# EAGLE design RedBoard (EAGLE 7.7.0)
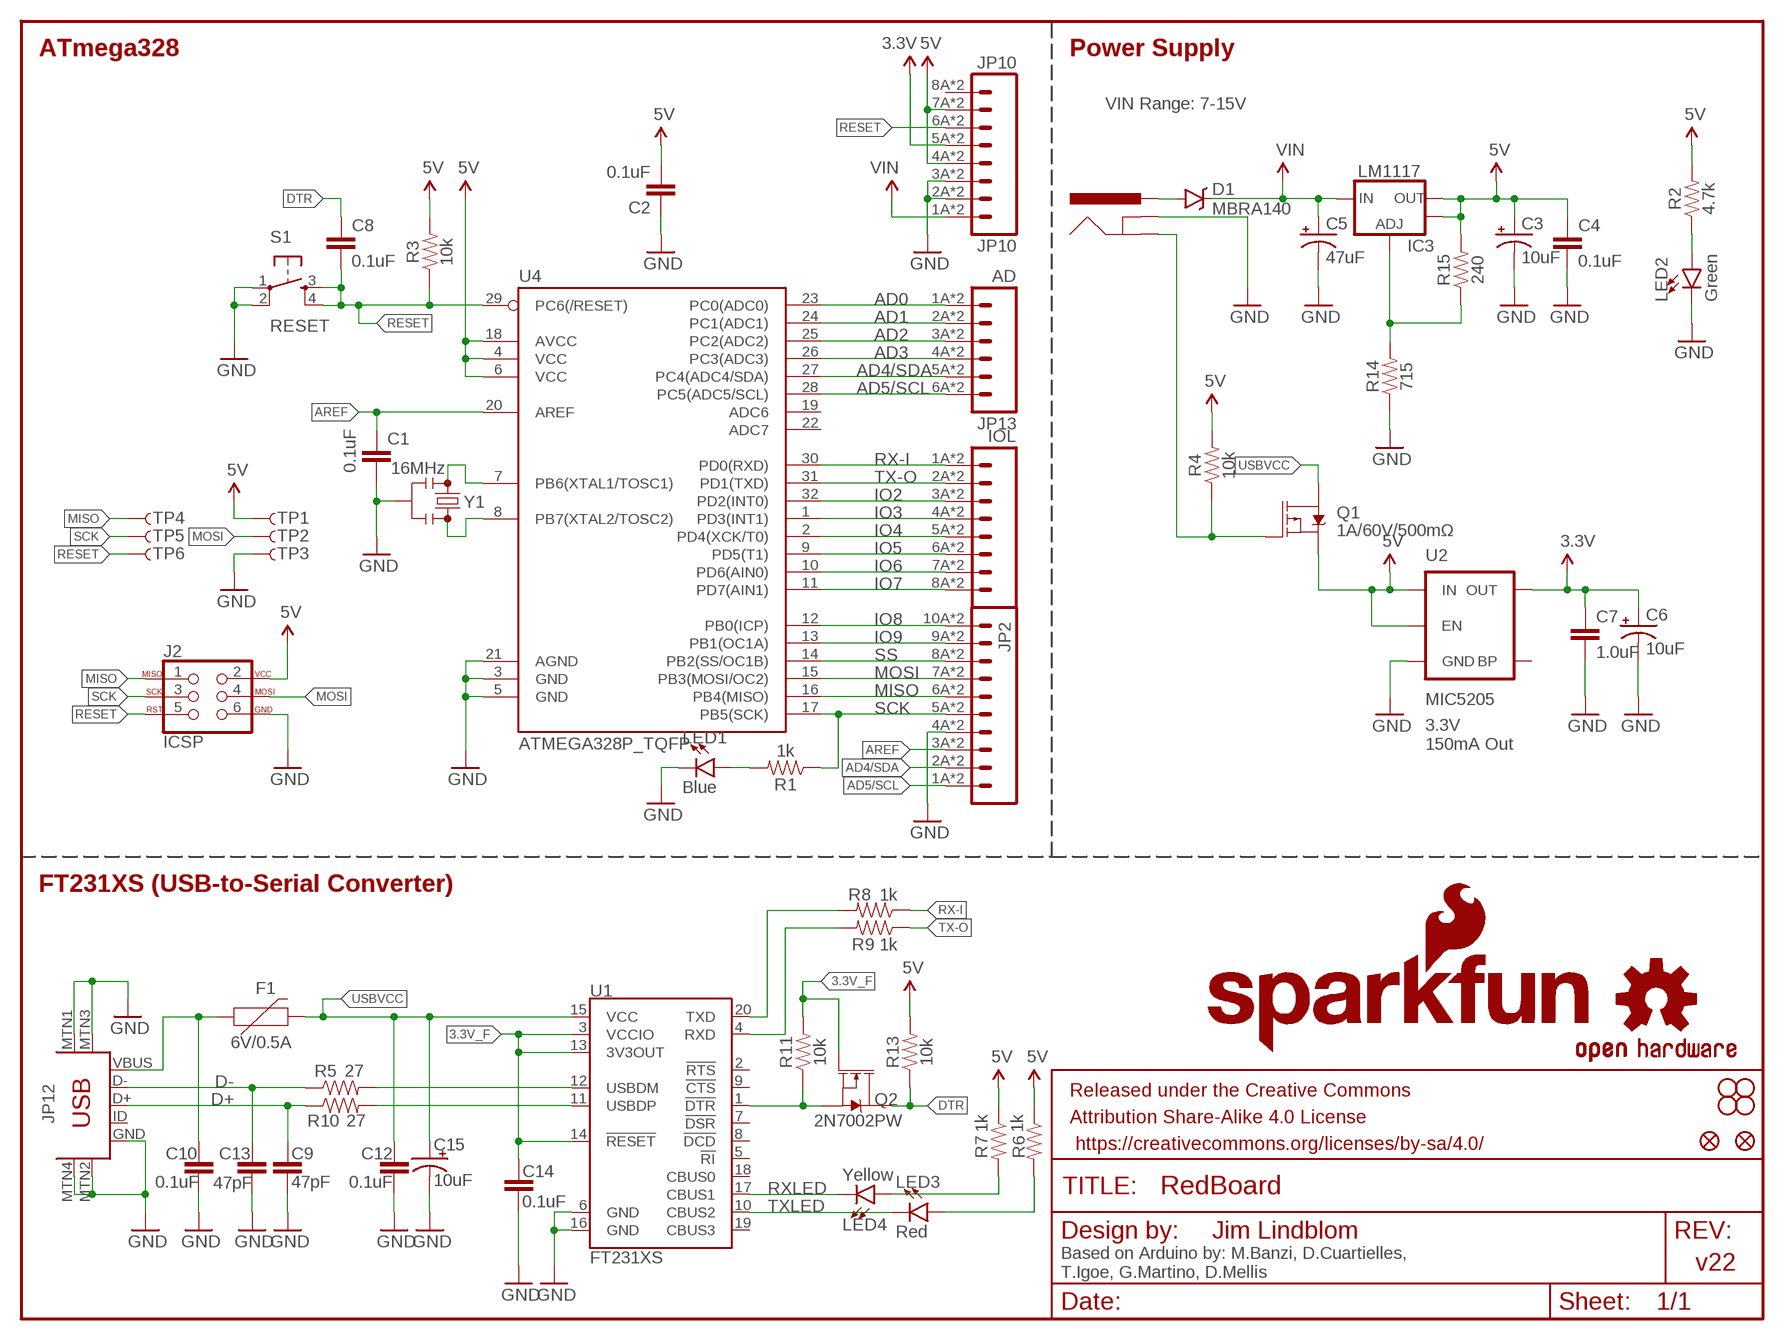
[diagram p0: schematic, sheet 1]

## Parts
C1  0.1uF  0.1UF-0603-25V-(+80/-20%)  [0603]
C2  0.1uF  0.1UF-0603-25V-(+80/-20%)  [0603]
C3  10uF  10UF-POLAR-EIA3216-16V-10%(TANT)  [EIA3216]
C4  0.1uF  0.1UF-0603-25V-(+80/-20%)  [0603]
C5  47uF  47UF-POLAR-PANASONIC_D-35V-20%  [PANASONIC_D]
C6  10uF  10UF-POLAR-EIA3216-16V-10%(TANT)  [EIA3216]
C7  1.0uF  1.0UF-0603-16V-10%  [0603]
C8  0.1uF  0.1UF-0603-25V-(+80/-20%)  [0603]
C9  47pF  47PF-0603-50V-5%  [0603]
C10  0.1uF  0.1UF-0603-25V-(+80/-20%)  [0603]
C12  0.1uF  0.1UF-0603-25V-(+80/-20%)  [0603]
C13  47pF  47PF-0603-50V-5%  [0603]
C14  0.1uF  0.1UF-0603-25V-(+80/-20%)  [0603]
C15  10uF  10UF-POLAR-EIA3216-16V-10%(TANT)  [EIA3216]
D1  MBRA140  [SMA-DIODE]
F1  6V/0.5A  PTC-HALF_AMP  [1206]
FRAME2  FRAME-LETTER  [CREATIVE_COMMONS]
IC3  LM1117  V_REG_LM1117ALT1  [SOT223-ALT1]
J2  ICSP  AVR_SPI_PROG_3X2SMD  [2X3_SMT_POSTS]
J3  POWER_JACKSUPER_BOMB_DIGITY  [POWER_JACK_SMD_OVERPASTE_SUPER_BOMB_DIGITY]
JP1  SFE_LOGO_NAME.1_INCH  [SFE_LOGO_NAME_.1]
JP2  M10SMD_COMBO  [1X10_SMD_COMBINED]
JP3  STAND-OFF  [STAND-OFF]
JP4  STAND-OFF  [STAND-OFF]
JP5  STAND-OFF  [STAND-OFF]
JP6  STAND-OFF  [STAND-OFF]
JP7  SFE_LOGO_FLAME.1_INCH  [SFE_LOGO_FLAME_.1]
JP8  FIDUCIAL1X2  [FIDUCIAL-1X2]
JP9  FIDUCIAL1X2  [FIDUCIAL-1X2]
JP10  JP10  M08SMD-COMBO  [1X08_SMD_COMBINED]
JP11  IOL  M08SMD-COMBO  [1X08_SMD_COMBINED]
JP12  USB-MINIB-5PIN  [USB-MINIB]
JP13  AD  M06SMD-STRAIGHT-COMBO  [1X06_SMD_STRAIGHT_COMBO]
LED1  Blue  LED1206  [LED-1206]
LED2  Green  LED1206  [LED-1206]
LED3  Red  LED1206  [LED-1206]
LED4  Yellow  LED1206  [LED-1206]
Q1  1A/60V/500mΩ  MOSFET-PCH-ZXMP6A13F  [SOT23-3]
Q2  2N7002PW  MOSFET-NCH-2N7002PW  [SOT323]
R1  1k  1KOHM-0603-1/10W-1%  [0603]
R2  4.7k  4.7KOHM-0603-1/10W-1%  [0603]
R3  10k  10KOHM-0603-1/10W-1%  [0603]
R4  10k  10KOHM-0603-1/10W-1%  [0603]
R5  27  27OHM-0603-1/10W-1%  [0603]
R6  1k  1KOHM-0603-1/10W-1%  [0603]
R7  1k  1KOHM-0603-1/10W-1%  [0603]
R8  1k  1KOHM-0603-1/10W-1%  [0603]
R9  1k  1KOHM-0603-1/10W-1%  [0603]
R10  27  27OHM-0603-1/10W-1%  [0603]
R11  10k  10KOHM-0603-1/10W-1%  [0603]
R13  10k  10KOHM-0603-1/10W-1%  [0603]
R14  715  715OHM-0603-1/10W-1%  [0603]
R15  240  240OHM-0603-1/10W-1%  [0603]
S1  RESET  SWITCH_SPST_4_PINSQUARE  [TACTILE-SWITCH-SMD]
TP1  TP-3x5  TEST-POINT3X5  [PAD.03X.05]
TP2  TP-3x5  TEST-POINT3X5  [PAD.03X.05]
TP3  TP-3x5  TEST-POINT3X5  [PAD.03X.05]
TP4  TP-3x5  TEST-POINT3X5  [PAD.03X.05]
TP5  TP-3x5  TEST-POINT3X5  [PAD.03X.05]
TP6  TP-3x5  TEST-POINT3X5  [PAD.03X.05]
U1  FT231XS  [SSOP20_L]
U2  MIC5205  MIC52053.3V  [SOT23-5]
U4  ATMEGA328P_TQFP  [TQFP32-08]
U$16  OSHW-LOGOS  [OSHW-LOGO-S]
Y1  16MHz  RESONATOR-16MHZSMD_3.2X1.3  [RESONATOR-SMD-3.2X1.3]

## Nets
3.3V: C6.+ C7.1 JP10.5A JP10.5B U2.5(OUT)
3.3V_F: C14.1 Q2.1(G) R11.2 U1.3(VCCIO) U1.13(3V3OUT) U1.14(!RESET)
5V: C2.2 C3.+ C4.1 IC3.2(OUT) IC3.4(OUT) J2.2 JP10.4A JP10.4B JP10.7A JP10.7B Q1.2(S) R2.2 R3.2 R4.2 R6.1 R7.1 R13.2 R15.2 TP1.P$1 U2.1(IN) U2.3(EN) U4.4(VCC) U4.6(VCC) U4.18(AVCC)
AD0: JP13.1A JP13.1B U4.23(PC0(ADC0))
AD1: JP13.2A JP13.2B U4.24(PC1(ADC1))
AD2: JP13.3A JP13.3B U4.25(PC2(ADC2))
AD3: JP13.4A JP13.4B U4.26(PC3(ADC3))
AD4/SDA: JP2.2A JP2.2B JP13.5A JP13.5B U4.27(PC4(ADC4/SDA))
AD5/SCL: JP2.1A JP2.1B JP13.6A JP13.6B U4.28(PC5(ADC5/SCL))
AREF: C1.1 JP2.3A JP2.3B U4.20(AREF)
D+: C9.1 JP12.D+ R10.1
D-: C13.1 JP12.D- R5.1
DTR: C8.1 Q2.3(D) R13.1
FTDI_DTR: Q2.2(S) R11.1 U1.1(!DTR)
GND: C1.2 C2.1 C3.- C4.2 C5.- C6.- C7.2 C9.2 C10.2 C12.2 C13.2 C14.2 C15.- J2.6 J3.GND(GNDBREAK) JP2.4A JP2.4B JP10.2A JP10.2B JP10.3A JP10.3B JP12.GND JP12.MTN1(MTN2) JP12.MTN2(MTN3) JP12.MTN3(MTN1) JP12.MTN4 LED1.C LED2.C R14.1 S1.1 S1.2 TP3.P$1 U1.6(GND) U1.16(GND) U2.2(GND) U4.3(GND) U4.5(GND) U4.21(AGND) Y1.2
INSERT: J3.P$4(GND) Q1.1(G) R4.1
IO2: JP11.3A JP11.3B U4.32(PD2(INT0))
IO3: JP11.4A JP11.4B U4.1(PD3(INT1))
IO4: JP11.5A JP11.5B U4.2(PD4(XCK/T0))
IO5: JP11.6A JP11.6B U4.9(PD5(T1))
IO6: JP11.7A JP11.7B U4.10(PD6(AIN0))
IO7: JP11.8A JP11.8B U4.11(PD7(AIN1))
IO8: JP2.10A JP2.10B U4.12(PB0(ICP))
IO9: JP2.9A JP2.9B U4.13(PB1(OC1A))
MISO: J2.1 JP2.6A JP2.6B TP4.P$1 U4.16(PB4(MISO))
MOSI: J2.4 JP2.7A JP2.7B TP2.P$1 U4.15(PB3(MOSI/OC2))
N$1: LED1.A R1.2
N$2: LED2.A R2.1
N$3: U4.7(PB6(XTAL1/TOSC1)) Y1.1
N$4: U4.8(PB7(XTAL2/TOSC2)) Y1.3
N$6: R5.2 U1.12(USBDM)
N$7: R10.2 U1.11(USBDP)
N$8: LED3.A R6.2
N$10: LED4.A R7.2
N$15: IC3.1(ADJ) R14.2 R15.1
PWRIN: D1.A J3.VIN0(PWR)
RESET: C8.2 J2.5 JP10.6A JP10.6B R3.1 S1.3 S1.4 TP6.P$1 U4.29(PC6(/RESET))
RX-I: JP11.1A JP11.1B R8.1 U4.30(PD0(RXD))
RXD: R9.2 U1.4(RXD)
RXLED: LED4.C U1.17(CBUS1)
SCK: J2.3 JP2.5A JP2.5B R1.1 TP5.P$1 U4.17(PB5(SCK))
SS: JP2.8A JP2.8B U4.14(PB2(SS/OC1B))
TX-O: JP11.2A JP11.2B R9.1 U4.31(PD1(TXD))
TXD: R8.2 U1.20(TXD)
TXLED: LED3.C U1.10(CBUS2)
USBVCC: C12.1 C15.+ F1.2 Q1.3(D) U1.15(VCC)
VIN: C5.+ D1.C IC3.3(IN) JP10.1A JP10.1B
VUSB: C10.1 F1.1 JP12.VBUS
Unconnected: JP10.8A JP10.8B JP12.ID U1.2(!RTS) U1.5(!RI) U1.7(!DSR) U1.8(!DCD) U1.9(!CTS) U1.18(CBUS0) U1.19(CBUS3) U2.4(BP) U4.19(ADC6) U4.22(ADC7)

## Notes on the sheet
- ATmega328 | Power Supply
- VIN Range: 7-15V
- 3.3V
  150mA Out
- FT231XS (USB-to-Serial Converter)
- Jim Lindblom
- v22
- Based on Arduino by: M.Banzi, D.Cuartielles, 
  T.Igoe, G.Martino, D.Mellis

## Library data of the parts
C1 C2 C4 C8 C10 C12 C14 = SparkFun-Capacitors:0.1UF: 0.1µF ceramic capacitors A capacitor is a passive two-terminal electrical component used to store electrical energy temporarily in an electric field.; PROD_ID: CAP-00810
C3 C6 C15 = SparkFun-Capacitors:10UF-POLAR: 10.0µF polarized capacitors A capacitor is a passive two-terminal electrical component used to store electrical energy temporarily in an electric field.; PROD_ID: CAP-00811
C5 = SparkFun-Capacitors:47UF-POLAR: 47µF polarized capacitors A capacitor is a passive two-terminal electrical component used to store electrical energy temporarily in an electric field.; PROD_ID: CAP-08478
C7 = SparkFun-Capacitors:1.0UF: 1µF ceramic capacitors A capacitor is a passive two-terminal electrical component used to store electrical energy temporarily in an electric field.; PROD_ID: CAP-00868
C9 C13 = SparkFun-Capacitors:47PF: 47pF ceramic capacitors A capacitor is a passive two-terminal electrical component used to store electrical energy temporarily in an electric field.; PROD_ID: CAP-08913
D1 = SparkFun-DiscreteSemi:MBRA140: 40V, 1A Schottky rectifier SMA/DO-214AC package DIO-08053; PROD_ID: DIO-08053
F1 = SparkFun-Fuses:PTC: Resettable Fuse PTC Resettable Fuse. Really a resistor with a postive temperature coefficient who's resistance increases dramatically with an increase in temperature. When heated by the power passing through the resistance rises causing the current to be limited, protecting the circuit. When a PTC cools back down it resumes conducting letting the circuit turn back on.; PROD_ID: RES-08585
FRAME2 = SparkFun-Aesthetics:FRAME-LETTER: Schematic Frame Standard 8.5x11 US Letter frame
IC3 = Testing:V_REG_LM1117: Voltage Regulator LM1117 Standard adjustable voltage regulator but in SMD form. Spark Fun Electronics SKU : COM-00595; PROD_ID: VREG-08170
J2 = SparkFun-Connectors:AVR_SPI_PROG_3X2: AVR ISP 6 Pin This is the reduced ISP connector for AVR programming. Common on Arduino. This footprint will take up less PCB space and can be used with a 10-pin to 6-pin adapter such as SKU: BOB-08508 **Special note about "TEST_POINT" package. The stop mask is on the top side, so if you want your programming test points to be on the bottom of your board, make sure to place this package on the bottom side of the board. This also ensure that the orientation to program from the bottom side will be correct.; PROD_ID: CONN-11415
J3 = Testing:POWER_JACK: Power Jack This is the standard 5.5mm barrel jack for power. The PTH is the most common, proven, reliable, footprint. All others are experimental. The Slot footprint only works if the mill layer is transmitted to the PCB fab house so be warned. Spark Fun Electronics SKU : PRT-00119. Mating wall wart : TOL-00298 (and others); PROD_ID: CONN-08106
JP1 = SparkFun-Aesthetics:SFE_LOGO_NAME: SFE Logo, name only This is the SparkFun name logo. The logo on the schematic will always be the same size; the package variant is the height of the flame part of the logo (or the height the flame would be, if it were drawn). Default layer for the logo on the board is tSilk.
JP2 = SparkFun-Connectors:M10: Header 10 Standard 10-pin 0.1" header. Use with straight break away headers (SKU : PRT-00116), right angle break away headers (PRT-00553), swiss pins (PRT-00743), machine pins (PRT-00117), and female headers (PRT-00115).; PROD_ID: CONN-11219
JP3-JP6 = SparkFun:STAND-OFF: Stand Off This is the mechanical footprint for a #4 phillips button head screw. Use the keepout ring to avoid running the screw head into surrounding components. SKU : PRT-00447
JP7 = SparkFun-Aesthetics:SFE_LOGO_FLAME: SFE Logo, flame only This is the SparkFun flame logo. The logo on the schematic will always be the same size; the package variant is the height of the flame. Default layer for the logo on the board is tSilk.
JP8 JP9 = SparkFun:FIDUCIAL: Fiducial Alignment Points Various fiducial points for machine vision alignment.
JP10 JP11 = SparkFun-Connectors:M08: Header 8 Standard 8-pin 0.1" header. Use with straight break away headers (SKU : PRT-00116), right angle break away headers (PRT-00553), swiss pins (PRT-00743), machine pins (PRT-00117), and female headers (PRT-00115).; PROD_ID: CONN-10204
JP12 = SparkFun-Connectors:USB-MINIB: Mini-USB "B" connector with 5th pin broken out. Created new symbol breaking out 5th "ID" pin in mini/micro USB connector spec. See: http://en.wikipedia.org/wiki/Mini_usb#Cables. Uses same footprint as 4-pin symbol. Also added pins to connect to mounting / shield pads if required (probably not generally needed as signals aren't shielded once they leave the connector).; PROD_ID: CONN-08193
JP13 = SparkFun-Connectors:M06: Header 6 Standard 6-pin 0.1" header. Use with straight break away headers (SKU : PRT-00116), right angle break away headers (PRT-00553), swiss pins (PRT-00743), machine pins (PRT-00117), and female headers (PRT-00115). Molex polarized connector foot print use with SKU : PRT-08094 with associated crimp pins and housings. NOTES ON THE VARIANTS LOCK and LOCK_LONGPADS... This footprint was designed to help hold the alignment of a through-hole component (i.e. 6-pin header) while soldering it into place. You may notice that each hole has been shifted either up or down by 0.005 of an inch from it's more standard position (which is a perfectly straight line). This slight alteration caused the pins (the squares in the middle) to touch the edges of the holes. Because they are alternating, it causes a "brace" to hold the component in place. 0.005 has proven to be the perfect amount of "off-center" position when using our standard breakaway headers. Although looks a little odd when you look at the bare footprint, once you have a header in there, the alteration is very hard to notice. Also,if you push a header all the way into place, it is covered up entirely on the bottom side. This idea of altering the position of holes to aid alignment will be further integrated into the Sparkfun Library for other footprints. It can help hold any component with 3 or more connection pins.; PROD_ID: CONN-10203
LED1 = SparkFun-LED:LED: LED (Generic) Standard schematic elements and footprints for 5mm, 3mm, 1206, and 0603 sized LEDs. Generic LEDs with no color specified.; PROD_ID: DIO-09911
LED2 = SparkFun-LED:LED: LED (Generic) Standard schematic elements and footprints for 5mm, 3mm, 1206, and 0603 sized LEDs. Generic LEDs with no color specified.; PROD_ID: DIO-09910
LED3 = SparkFun-LED:LED: LED (Generic) Standard schematic elements and footprints for 5mm, 3mm, 1206, and 0603 sized LEDs. Generic LEDs with no color specified.; PROD_ID: DIO-09912
LED4 = SparkFun-LED:LED: LED (Generic) Standard schematic elements and footprints for 5mm, 3mm, 1206, and 0603 sized LEDs. Generic LEDs with no color specified.; PROD_ID: DIO-09909
Q1 = SparkFun-DiscreteSemi:MOSFET-PCH: P-channel MOSFETs Voltage controlled devices that allow control of high current outputs.; PROD_ID: TRANS-08285
Q2 = SparkFun-DiscreteSemi:MOSFET-NCH: N-channel MOSFETs Voltage controlled devices that allow control of high current outputs.; PROD_ID: TRANS-11151; VALUE: 310mA/60V/1.6Ω
R1 R6-R9 = SparkFun-Resistors:1KOHM: 1kΩ resistor A resistor is a passive two-terminal electrical component that implements electrical resistance as a circuit element. Resistors act to reduce current flow, and, at the same time, act to lower voltage levels within circuits.; PROD_ID: RES-07856
R2 = SparkFun-Resistors:4.7KOHM: 4.7kΩ resistor A resistor is a passive two-terminal electrical component that implements electrical resistance as a circuit element. Resistors act to reduce current flow, and, at the same time, act to lower voltage levels within circuits.; PROD_ID: RES-07857
R3 R4 R11 R13 = SparkFun-Resistors:10KOHM: 10kΩ resistor A resistor is a passive two-terminal electrical component that implements electrical resistance as a circuit element. Resistors act to reduce current flow, and, at the same time, act to lower voltage levels within circuits.; PROD_ID: RES-00824
R5 R10 = SparkFun-Resistors:27OHM: 27Ω resistor A resistor is a passive two-terminal electrical component that implements electrical resistance as a circuit element. Resistors act to reduce current flow, and, at the same time, act to lower voltage levels within circuits.; PROD_ID: RES-09334
R14 = SparkFun-Resistors:715OHM: 715Ω resistor A resistor is a passive two-terminal electrical component that implements electrical resistance as a circuit element. Resistors act to reduce current flow, and, at the same time, act to lower voltage levels within circuits.; PROD_ID: RES-07850
R15 = SparkFun-Resistors:240OHM: 240Ω resistor A resistor is a passive two-terminal electrical component that implements electrical resistance as a circuit element. Resistors act to reduce current flow, and, at the same time, act to lower voltage levels within circuits.; PROD_ID: RES-07849
S1 = SparkFun-Electromechanical:SWITCH_SPST_4_PIN; PROD_ID: SWCH-08247
TP1-TP4 TP6 = SparkFun-Connectors:TEST-POINT: Bare copper test points for troubleshooting or ICT
TP5 = SparkFun-Passives:TEST-POINT: Bare copper test points for troubleshooting or ICT
U1 = SparkFun-IC-Comms:FT231X: FTDI FT231X Full Speed USB to Full-handshake UART This USB2.0 Full Speed IC offers a compact bridge to full handshake UART interfaces. The device is a UART, capable of operating up to 3MBaud, with low power consumption (8mA). The FT231X includes the complete FT-X series feature set and enables USB to be added into a system design quickly and easily over a UART interface.; PROD_ID: IC-11524
U2 = SparkFun-PowerIC:MIC5205: MIC5205 150mA vreg 3.3V - VREG-00822 5V - VREG-00823; PROD_ID: VREG-00822
U4 = SparkFun-IC-Microcontroller:ATMEGA328P_TQFP; PROD_ID: IC-09069
U$16 = SparkFun-Aesthetics:OSHW-LOGO: Open Source Hardware Logo This logo indicates the piece of hardware it is found on incorporates a OSHW license and/or adheres to the definition of open source hardware found here: http://freedomdefined.org/OSHW
Y1 = SparkFun-Clocks:RESONATOR-16MHZ: 16MHz Resonator Digikey Example <http://www.digikey.com/product-detail/en/murata-electronics-north-america/CSTCE16M0V53-R0/490-1198-1-ND/584635> Frequency: 16MHz Frequency Stability: ±0.3% Frequency Tolerance: ±0.5% Capacitance: 15pF; PROD_ID: XTAL-08900

## Net classes
0 default: width 0.152 mm, drill 0.305 mm, clearance 0.152 mm

## Board
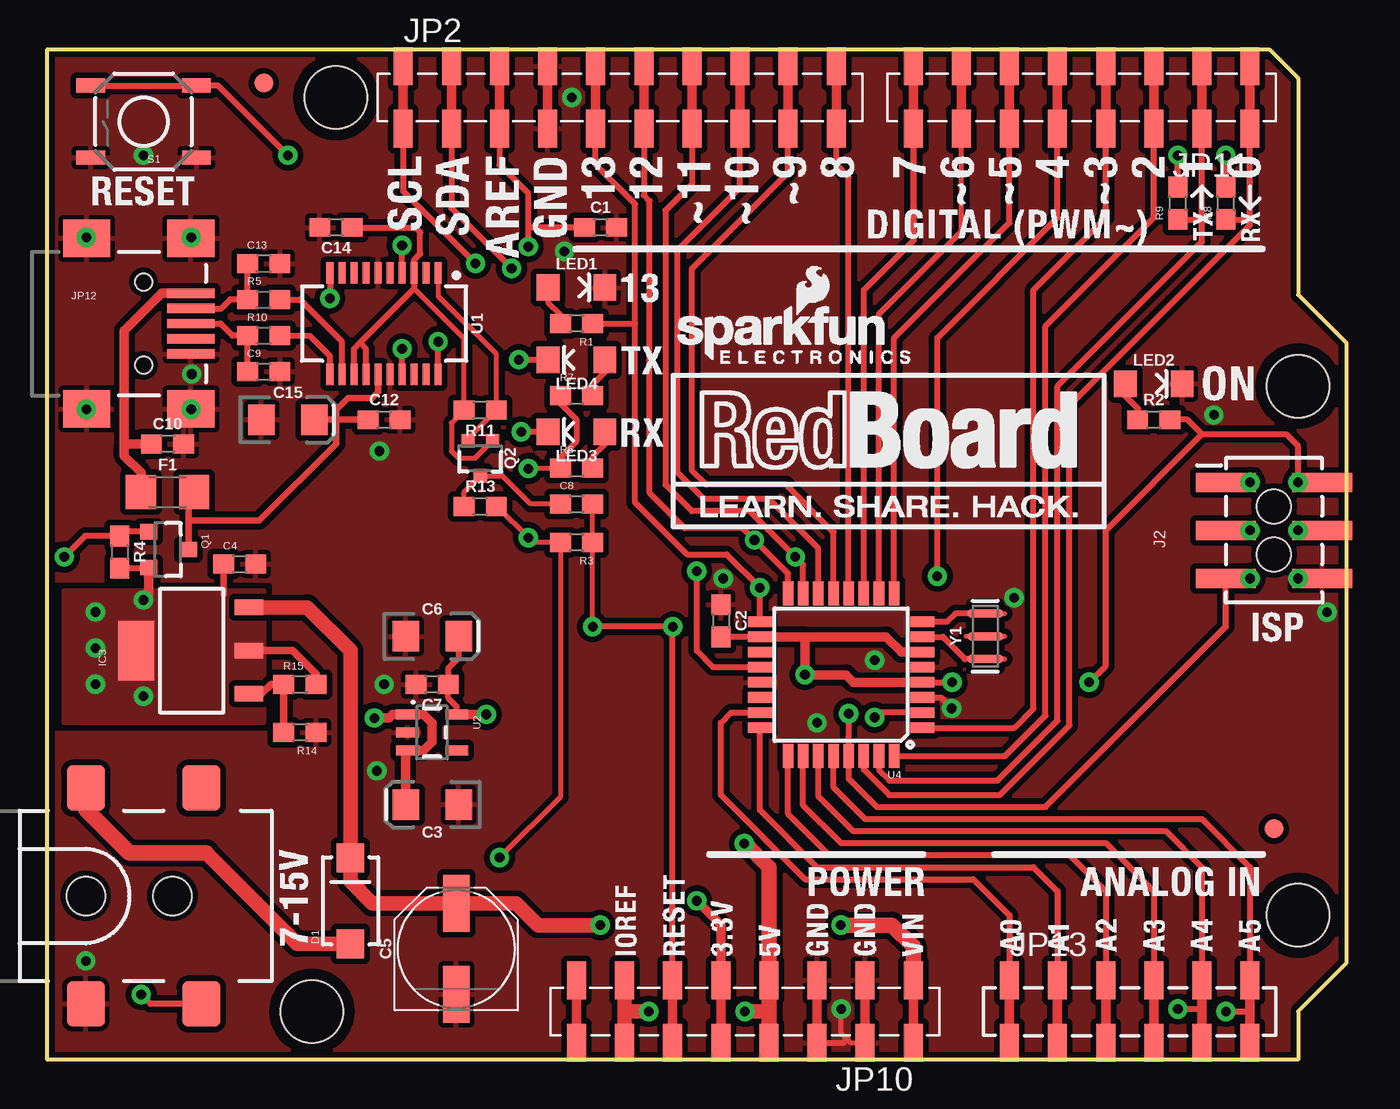
[diagram p1: board, top side]
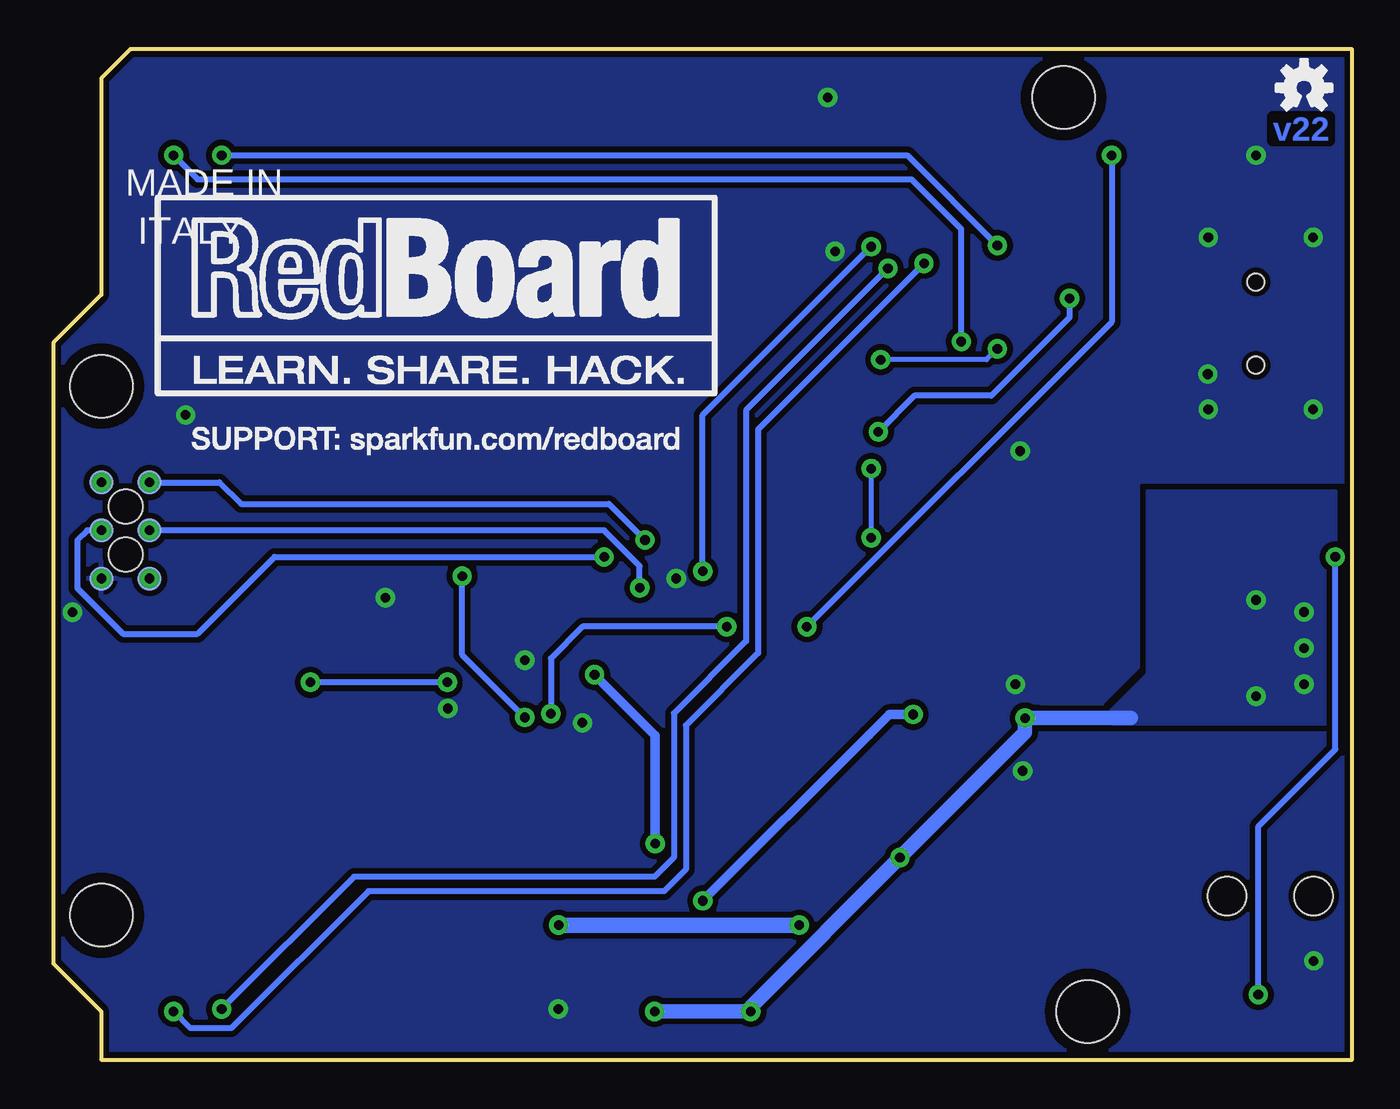
[diagram p2: board, bottom side, seen from below]

Size 68.58 x 53.34 mm. Coordinates in mm from the lower left corner, seen from the top.
Outline: 0,53.34 64.52,53.34 66.04,51.82 66.04,40.39 68.58,37.85 68.58,5.08 66.04,2.54 66.04,0 0,0 0,53.34
Copper layers (1*16): Top 0.035mm / dielectric 1.5mm / Bottom 0.035mm
Design rules "SparkFun-2-layer": minimum track width 7mil, minimum drill 15mil, track to track 8mil, track to pad 8mil, pad to pad 8mil, via to via 8mil, smd to smd 8mil, copper to edge 8mil, drill to drill 8mil, minimum pad ring 12mil, minimum via ring 10mil, stop-mask expansion 4mil, vias tented up to drill 20mil, thermal gap 10mil
vRestrict: area 0.6,22.4 to 2,30.6; area 5.7,23.1 to 7.4,30.6; area 47.9,10.8 to 48.5,11.3; area 50.4,10.7 to 50.9,11.6; area 11.3,29.3 to 12.7,31.6; area 0.3,13 to 9.4,25

### Footprints (pad centres in the part's own frame; a part is rotated, then mirrored left to right if it is on the bottom)
0603 = smd 1.1 x 1: 1 -0.85,0; 2 0.85,0
EIA3216 = smd 1.4 x 1.6: + 1.4,0; - -1.4,0
PANASONIC_D = smd 3 x 1.4: + 2.4,0; - -2.4,0
SMA-DIODE = smd 1.524 x 1.47: A -2.277,0; C 2.277,0
1206 = smd 1.6 x 1.8: 1 -1.4,0; 2 1.4,0
SOT223-ALT1 = smd 0.813 x 1.524: 1 -2.271,-3.02; 2 0,-3.02; 3 2.288,-3.02 | smd 3.124 x 1.905: 4 0,2.921
2X3_SMT_POSTS = smd 1 x 3.17: 1 -2.54,-2.54; 2 -2.54,2.54; 3 0,-2.54; 4 0,2.54; 5 2.54,-2.54; 6 2.54,2.54 | hole 1.8: -1.27,0; 1.27,0
POWER_JACK_SMD_OVERPASTE_SUPER_BOMB_DIGITY = smd 2 x 2.4: GND 0,-5.7; P$4 6.1,-5.7; VIN0 0,5.7; VIN1 6.1,5.7 | hole 2.032: 0,0; 4.572,0
1X10_SMD_COMBINED = smd 1 x 2: 1A 0,1.65; 1B 0,-1.65; 2A 2.54,1.65; 2B 2.54,-1.65; 3A 5.08,1.65; 3B 5.08,-1.65; 4A 7.62,1.65; 4B 7.62,-1.65; 5A 10.16,1.65; 5B 10.16,-1.65; 6A 12.7,1.65; 6B 12.7,-1.65; 7A 15.24,1.65; 7B 15.24,-1.65; 8A 17.78,1.65; 8B 17.78,-1.65; 9A 20.32,1.65; 9B 20.32,-1.65; 10A 22.86,1.65; 10B 22.86,-1.65
STAND-OFF = hole 3.302: 0,0
FIDUCIAL-1X2 = smd 1 x 1: 1 0,0
1X08_SMD_COMBINED = smd 1 x 2: 1A 0,1.65; 1B 0,-1.65; 2A 2.54,-1.65; 2B 2.54,1.65; 3A 5.08,1.65; 3B 5.08,-1.65; 4A 7.62,-1.65; 4B 7.62,1.65; 5A 10.16,1.65; 5B 10.16,-1.65; 6A 12.7,-1.65; 6B 12.7,1.65; 7A 15.24,1.65; 7B 15.24,-1.65; 8A 17.78,-1.65; 8B 17.78,1.65
USB-MINIB = smd 2.5 x 0.5: D+ 2.5,0; D- 2.5,0.8; GND 2.5,-1.6; ID 2.5,-0.8; VBUS 2.5,1.6 | smd 2.5 x 2: MTN1 -3,4.5; MTN2 2.5,4.5; MTN3 -3,-4.5; MTN4 2.5,-4.5 | hole 0.9: 0,2.2; 0,-2.2
1X06_SMD_STRAIGHT_COMBO = smd 1 x 2: 1A 0,-1.65; 1B 0,1.65; 2A 2.54,1.65; 2B 2.54,-1.65; 3A 5.08,-1.65; 3B 5.08,1.65; 4A 7.62,1.65; 4B 7.62,-1.65; 5A 10.16,-1.65; 5B 10.16,1.65; 6A 12.7,1.65; 6B 12.7,-1.65
LED-1206 = smd 1.2 x 1.4: A -1.5,0; C 1.5,0
SOT23-3 = smd 0.8 x 0.9: 1 -0.95,-1; 2 0.95,-1; 3 0,1.1
SOT323 = smd 0.7 x 0.7: 1 -0.65,-0.925; 2 0.65,-0.925; 3 0,0.925
TACTILE-SWITCH-SMD = smd 1.524 x 0.762: 1 -2.794,1.905; 2 2.794,1.905; 3 -2.794,-1.905; 4 2.794,-1.905
PAD.03X.05 = smd 1.27 x 1.27: P$1 0,0
SSOP20_L = smd 0.381 x 1.143: 1 -2.857,-2.68; 2 -2.223,-2.68; 3 -1.587,-2.68; 4 -0.953,-2.68; 5 -0.318,-2.68; 6 0.318,-2.68; 7 0.953,-2.68; 8 1.587,-2.68; 9 2.223,-2.68; 10 2.857,-2.68; 11 2.857,2.68; 12 2.223,2.68; 13 1.587,2.68; 14 0.953,2.68; 15 0.318,2.68; 16 -0.318,2.68; 17 -0.953,2.68; 18 -1.587,2.68; 19 -2.223,2.68; 20 -2.857,2.68
SOT23-5 = smd 0.55 x 1.2: 1 -0.95,-1.3; 2 0,-1.3; 3 0.95,-1.3; 4 0.95,1.3; 5 -0.95,1.3
TQFP32-08 = smd 1.27 x 0.559: 1 -4.293,2.8; 2 -4.293,2; 3 -4.293,1.2; 4 -4.293,0.4; 5 -4.293,-0.4; 6 -4.293,-1.2; 7 -4.293,-2; 8 -4.293,-2.8; 17 4.293,-2.8; 18 4.293,-2; 19 4.293,-1.2; 20 4.293,-0.4; 21 4.293,0.4; 22 4.293,1.2; 23 4.293,2; 24 4.293,2.8 | smd 0.559 x 1.27: 9 -2.8,-4.293; 10 -2,-4.293; 11 -1.2,-4.293; 12 -0.4,-4.293; 13 0.4,-4.293; 14 1.2,-4.293; 15 2,-4.293; 16 2.8,-4.293; 25 2.8,4.293; 26 2,4.293; 27 1.2,4.293; 28 0.4,4.293; 29 -0.4,4.293; 30 -1.2,4.293; 31 -2,4.293; 32 -2.8,4.293
RESONATOR-SMD-3.2X1.3 = smd 0.45 x 1.905: 1 -1.2,0; 2 0,0; 3 1.2,0

### Placement (x,y rotation side)
C1  29.21,43.94 0 top
C2  35.56,23.17 270 top
C3  20.32,13.46 180 top
C4  10.16,26.16 0 top
C5  21.59,5.84 90 top
C6  20.32,22.35 0 top
C7  20.32,19.81 180 top
C8  27.94,29.34 0 top
C9  11.43,36.32 0 top
C10  6.35,32.51 0 top
C12  17.78,33.78 0 top
C13  11.43,42.04 0 top
C14  15.24,43.94 180 top
C15  12.7,33.78 0 top
D1  16,8.38 90 top
F1  6.35,29.97 0 top
FRAME2  1.27,-39.37 0 top  (outside the outline)
IC3  7.62,21.59 90 top
J2  64.77,27.94 270 top
J3  2.03,8.64 0 top
JP1  32.79,36.45 0 top
JP2  18.8,50.8 0 top
JP3  13.97,2.54 0 top
JP4  66.04,7.62 0 top
JP5  66.04,35.56 0 top
JP6  15.24,50.8 0 top
JP7  39.27,38.99 0 top
JP8  64.77,12.19 0 top
JP9  11.43,51.56 0 top
JP10  45.72,2.54 180 top
JP11  63.5,50.8 180 top
JP12  5.08,38.86 0 top
JP13  50.8,2.54 0 top
LED1  27.94,40.77 0 top
LED2  58.42,35.69 0 top
LED3  27.94,33.15 180 top
LED4  27.94,36.96 180 top
Q1  6.35,26.92 270 top
Q2  22.86,31.75 180 top
R1  27.94,38.86 180 top
R2  58.42,33.78 0 top
R3  27.94,27.3 180 top
R4  3.81,26.8 270 top
R5  11.43,40.13 0 top
R6  27.94,31.24 0 top
R7  27.94,35.05 0 top
R8  62.23,45.21 90 top
R9  59.69,45.21 90 top
R10  11.43,38.23 0 top
R11  22.86,34.29 180 top
R13  22.86,29.21 0 top
R14  13.34,17.27 180 top
R15  13.34,19.81 0 top
S1  5.08,49.53 180 top
TP1  66.04,30.48 0 bottom
TP2  66.04,27.94 0 bottom
TP3  66.04,25.4 0 bottom
TP4  63.5,30.48 0 bottom
TP5  63.5,27.94 0 bottom
TP6  63.5,25.4 0 bottom
U1  17.78,38.86 180 top
U2  20.32,17.27 270 top
U4  41.91,20.32 180 top
U$16  2.54,51.31 0 bottom
Y1  49.53,22.35 90 top

### Tracks (layer width: path | path; a pad name or v marks a point on that pad's centre or on a via)
3.3V  (via drill 0.51)
  Top 0.305: U2.5 21.62,18.64 21.17,19.09 C7.1 21.17,20.66 21.72,21.21 C6.+
  Top 0.508: JP10.5A 35.56,7.11 v34.29,8.38 | U2.5 v23.18,18.22
  Bottom 0.508: v34.29,8.38 25.53,17.14 25.52,17.14 24.45,18.22 v23.18,18.22
3.3V_F
  Top 0.254: 19.37,40.7 22.01,38.06 R11.2 21.34,33.62 21.34,32.13 21.72,31.75 22.59,31.75 Q2.1
  Top 0.305: C14.1 19.43,43.94 19.68,43.69 19.68,42.55 19.37,42.23 U1.3 19.37,40.7 16.51,37.85 | U1.13 16.19,37.53 16.51,37.85 | U1.14 16.83,37.53 16.51,37.85
5V  (via drill 0.51, 0.51 pad 0.51)
  Top 0.254: 27.09,31.2 v25.4,31.2 | R13.2 23.75,29.21 v25.4,27.56 25.65,27.3 R3.2 27.09,13.88 v23.88,10.67
  Top 0.305: U4.18 C2.2 | U4.4 v47.77,19.92 | 60.96,33.02 65.41,33.02 66.04,32.38 TP1.P$1 J2.2 | JP10.4A 38.1,2.03 | 60.96,33.02 55.88,27.94 55.88,20.79 v55.01,19.92 | 60.96,33.02 60.2,33.78 R2.2 | R7.1 27.09,34.63 27.94,33.78 27.94,32.64 27.09,31.79 R6.1 27.09,31.2 | R4.2 5.32,25.95 Q1.2
  Top 0.356: C4.1 9.31,24.55
  Top 0.406: IC3.2 12.95,21.59 14.19,20.36 R15.2 | C3.+ 19.05,13.46
  Top 0.508: U4.6 45.09,21.52 44.28,22.32 40.01,22.32 | 40.01,22.32 U4.18 | 40.01,22.32 v40.01,20.32 42.16,20.32 42.56,19.92 U4.4 | C3.+ 18.92,16.22 U2.3 19.88,16.32 20.32,16.76 20.32,17.78 19.88,18.22 U2.1 18.22,18.22 18.03,18.03 v17.27,18.03 | Q1.2 5.35,24.54 v5.08,24.27
  Top 0.762: v36.8,11.4 36.8,11.46 38.1,10.16 | v36.83,2.54 37.85,2.54 38.1,2.79 | v31.75,2.54 30.48,2.54 | 30.48,2.54 JP10.7A | JP10.7B 30.48,2.54
  Top 0.813: 38.1,10.16 JP10.4A 38.1,2.79 38.1,2.03 JP10.4B
  Bottom 0.254: v25.4,31.2 v25.4,27.56
  Bottom 0.305: v47.77,19.92 v55.01,19.92
  Bottom 0.508: v36.8,11.4 36.8,17.11 v40.01,20.32
  Bottom 0.762: v36.83,2.54 v31.75,2.54 31.75,2.79 v23.88,10.67 17.27,17.27 v17.27,18.03 | v17.27,18.03 11.68,18.03 | 16.51,18.03 v17.27,18.03
  other vias: 2.54,21.73 5.08,19.19 2.54,19.82 2.54,23.63 66.04,30.48
  pour Bottom (isolate 0.305, no thermals): 0.89,29.97 10.79,29.97 10.79,20.32 12.7,18.41 12.7,17.78 0.89,17.78
  pour Top (isolate 0.305, no thermals): 0.89,17.78 0.89,24.77 11.43,24.77 11.43,17.78
AD0
  Top 0.305: U4.23 36.1,18.32 35.56,17.78 35.56,13.97 40.01,9.53 48.9,9.53 50.8,7.62 JP13.1A
AD1
  Top 0.305: U4.24 37.62,13.18 40.64,10.16 52.07,10.16 53.34,8.89 JP13.2A
AD2
  Top 0.305: U4.25 39.11,12.96 41.27,10.79 53.98,10.79 55.88,8.89 JP13.3A
AD3
  Top 0.305: U4.26 39.91,13.43 41.91,11.43 55.88,11.43 58.42,8.89 JP13.4A
AD4/SDA  (via drill 0.51)
  Top 0.305: U4.27 40.71,13.9 42.55,12.06 59.05,12.06 60.96,10.16 60.96,2.67 | 60.96,2.67 JP13.5A | JP2.2B 21.34,44.96 v24.51,41.78 | v59.69,2.67 60.96,2.67
  Bottom 0.305: v59.69,2.67 52.7,9.65 36.83,9.65 35.81,10.67 35.81,18.29 32,22.1 32,34.29 v24.51,41.78
AD5/SCL  (via drill 0.51)
  Top 0.305: U4.28 41.51,14.37 43.18,12.7 60.96,12.7 63.5,10.16 JP13.6A 63.5,2.54 v62.23,2.54 | JP2.1B 18.8,45.85 v22.61,42.04
  Bottom 0.305: v22.61,42.04 31.37,33.27 31.37,21.46 35.18,17.65 35.18,10.03 36.32,8.89 51.94,8.89 59.18,1.65 61.34,1.65 v62.23,2.54
AREF  (via drill 0.51)
  Top 0.305: U4.20 35.16,20.72 34.29,21.59 v34.29,25.78 | JP2.3B 23.88,47.24 25.4,45.72 25.4,43.94 | v25.4,42.93 25.4,43.94 | C1.1 25.4,43.94
  Bottom 0.305: v25.4,42.93 34.29,34.04 v34.29,25.78
D+
  Top 0.305: R10.1 10.58,38.44 | JP12.D+ 9.14,38.86 9.78,38.23 R10.1 | C9.1 R10.1
D-
  Top 0.305: JP12.D- 9.18,39.66 9.65,40.13 R5.1 C13.1
DTR
  Top 0.254: R13.1 22.01,29.98 Q2.3 24.04,30.82 25.53,29.34 C8.1
FTDI_DTR
  Top 0.254: U1.1 20.64,40.32 23.71,37.25 R11.1 22.21,32.79 Q2.2
GND  (via drill 0.51, 0.51 pad 0.51)
  Top 0.254: JP10.2B 42.42,0.89 42.23,1.08 41.91,1.4 v41.91,2.67
  Top 0.305: U4.3 47.17,19.12 v47.75,18.54 | JP10.3A 42.04,0.89 42.23,1.08
  other vias: 5.08,47.75 61.59,34.04 40.64,17.78 27.69,50.8 43.69,21.08 51.05,24.38 35.69,25.4 2.03,5.21 7.62,36.2 27.3,42.67 67.56,23.62 17.53,32.13 17.78,19.81 17.4,15.24 66.04,25.4 2.06,34.34 7.59,34.34 2.06,43.41 7.59,43.41
  pour Top (isolate 0.305, rank 2): 0,53.34 64.52,53.34 66.04,51.82 66.04,40.39 68.58,37.85 68.58,5.08 66.04,2.54 66.04,0 0,0
  pour Bottom (isolate 0.305, rank 2): 0,53.34 64.52,53.34 66.04,51.82 66.04,40.39 68.58,37.85 68.58,5.08 66.04,2.54 66.04,0 0,0
INSERT  (via drill 0.51)
  Top 0.305: J3.P$4 5.45,2.94 v4.95,3.43 | Q1.1 4.04,27.87 R4.1 1.99,27.65 v0.89,26.54
  Bottom 0.305: v4.95,3.43 4.95,12.32 0.89,16.38 v0.89,26.54
IO2
  Top 0.305: JP11.3A 58.42,44.45 52.7,38.73 52.7,18.16 50.57,16.03 U4.32
IO3
  Top 0.305: JP11.4A 55.88,44.45 52.07,40.64 52.07,18.54 51.05,17.52 U4.1
IO4  (via drill 0.51)
  Top 0.305: v46.99,25.53 46.99,38.1 53.34,44.45 JP11.5A | U4.2 43.94,18.32 v43.69,18.07
  Bottom 0.305: v43.69,18.07 46.99,21.37 v46.99,25.53
IO5
  Top 0.305: U4.9 44.71,38.1 50.8,44.19 JP11.6A
IO6
  Top 0.254: 48.26,43.72 JP11.7A
  Top 0.305: U4.10 43.91,39.37 48.26,43.72
IO7
  Top 0.305: U4.11 43.11,40.64 45.72,43.25
  Top 0.356: 45.72,43.25 JP11.8A
IO8
  Top 0.305: U4.12 42.31,46.59 41.66,47.24 JP2.10B
IO9
  Top 0.305: JP2.9B 39.12,46.84 34.04,41.76 34.04,31.11 34.8,30.35 38.99,30.35 41.51,27.83 U4.13
MISO  (via drill 0.51, 0.51 pad 0.51)
  Top 0.305: U4.16 39.11,25.66 v37.34,27.43 36.7,28.07 33.66,28.07 31.8,29.92 31.8,45.34 31.5,45.64 JP2.6B | J2.1 TP4.P$1
  Bottom 0.305: v37.34,27.43 39.24,29.34 58.67,29.34 59.82,30.48 TP4.P$1
  other vias: 63.5,30.48
MOSI  (via drill 0.51, 0.51 pad 0.51)
  Top 0.305: U4.15 39.91,26.13 v39.5,26.54 37.08,28.96 34.04,28.96 32.64,30.35 32.64,44.83 34.04,46.23 JP2.7B | J2.4 TP2.P$1
  Bottom 0.305: v39.5,26.54 56.9,26.54 60.96,22.48 64.9,22.48 67.31,24.89 67.31,27.43 66.8,27.94 TP2.P$1
  other vias: 66.04,27.94
N$1
  Top 0.305: R1.2 27.09,39.33 26.44,39.98 LED1.A
N$2
  Top 0.356: R2.1 57.57,34.38 56.92,35.03 LED2.A
N$3
  Top 0.305: U4.7 47.28,22.32 48.44,21.15 Y1.1
N$4
  Top 0.305: U4.8 47.5,23.12 47.94,23.55 Y1.3
N$6
  Top 0.305: R5.2 13.34,40.13 15.56,37.91 U1.12
N$7
  Top 0.305: U1.11 14.92,37.15 13.84,38.23 R10.2
N$8
  Top 0.305: LED3.A 29.44,32.49 28.79,31.84 R6.2
N$10
  Top 0.305: LED4.A 29.44,36.3 28.79,35.65 R7.2
N$15
  Top 0.406: IC3.1 11.32,19.32 11.81,19.81 R15.1 R14.2
PWRIN
  Top 0.762: 8.38,10.92 13.2,6.11 D1.A
  Top 0.813: 8.38,10.92 4.32,10.92 2.03,13.21 J3.VIN0
RESET  (via drill 0.51, 0.51 pad 0.51)
  Top 0.254: C8.2 R3.1 v28.79,22.86
  Top 0.305: v42.31,18.27 U4.29 42.31,14.84 43.81,13.34 52.7,13.34 62.23,22.86 J2.5 TP6.P$1 | v12.7,47.75 9.02,51.44 S1.3 S1.4 | JP10.6B JP10.6A v33.02,22.86 v28.79,22.86
  Bottom 0.305: v42.31,18.27 42.31,21.19 40.64,22.86 v33.02,22.86 | v12.7,47.75 12.7,38.95 v28.79,22.86
  other vias: 63.5,25.4
RX-I
  Top 0.254: 63.5,46.35 63.52,46.37
  Top 0.305: 63.5,44.32 63.5,44.07 53.98,34.54 53.98,17.65 50.29,13.97 44.45,13.97 43.11,15.31 U4.30 | 63.5,44.32 63.5,46.35 JP11.1A | R8.1 63.46,44.36 63.5,44.32
RXD  (via drill 0.51)
  Top 0.305: R9.2 v59.69,47.75 | U1.4 v18.73,42.99
  Bottom 0.305: v59.69,47.75 23.5,47.75 v18.73,42.99
RXLED  (via drill 0.51)
  Top 0.305: U1.17 v18.73,37.53 | v24.89,36.96 LED4.C
  Bottom 0.254: v18.73,37.53 19.3,36.96 v24.89,36.96
SCK  (via drill 0.51, 0.51 pad 0.51)
  Top 0.305: U4.17 v37.62,24.92 35.87,26.67 33.78,26.67 31.04,29.41 31.04,38.86 | JP2.5B 28.96,47.24 31.04,45.16 31.04,38.86 | R1.1 31.04,38.86 | J2.3 TP5.P$1
  Bottom 0.305: v37.62,24.92 37.62,26.06 39.5,27.94 TP5.P$1
  other vias: 63.5,27.94
SS
  Top 0.305: JP2.8B 36.58,46.04 33.27,42.74 33.27,30.99 34.67,29.59 38.1,29.59 40.71,26.98 U4.14
TX-O
  Top 0.254: 60.96,46.35 60.95,46.37
  Top 0.305: U4.31 43.91,15.27 44.45,14.73 50.16,14.73 53.34,17.91 53.34,35.56 60.96,43.18 60.96,44.32 | 60.96,44.32 60.96,46.35 JP11.2A | R9.1 60.92,44.36 60.96,44.32
TXD  (via drill 0.51)
  Top 0.305: R8.2 v62.23,47.75 | U1.20 v20.64,37.91
  Bottom 0.305: v62.23,47.75 60.96,46.48 23.27,46.48 20.64,43.85 v20.64,37.91
TXLED  (via drill 0.51)
  Top 0.305: U1.10 v14.92,40.2 | LED3.C v25.02,33.15
  Bottom 0.305: v14.92,40.2 14.92,39.18 19.05,35.05 23.11,35.05 v25.02,33.15
USBVCC
  Top 0.356: C15.+ 15.24,33.78 | U1.15 17.46,35.24 17.14,34.92 15.88,34.92 15.24,34.29 15.24,33.78 | C12.1 15.24,33.78 | 15.24,33.78 15.24,32.51 11.18,28.45 7.45,28.45 | Q1.3 7.45,28.45 | 7.45,28.45 7.45,29.68 F1.2
VIN  (via drill 0.51)
  Top 0.305: JP10.1A JP10.1B
  Top 0.762: v29.2,7.1 25.9,7.1 24.76,8.24 C5.+ 17.16,8.24 16,9.4 D1.C 16,21.59 13.72,23.88 IC3.3
  Top 0.813: v41.9,7.1 44.59,7.1 45.72,5.97 JP10.1B
  Bottom 0.813: v29.2,7.1 v41.9,7.1
VUSB
  Top 0.508: 4.06,32.51 4.06,38.48 6.04,40.46 JP12.VBUS | C10.1 4.06,32.51 | 4.06,32.51 4.06,31.88 4.95,30.99 F1.1

### Text on the board
Bottom: v22
bNames: MADE IN | ITALY
Measures: Units in inches
tDocu: J.Lindblom | Based on Arduino by: M.Banzi, D.Cuartielles, / T.Igoe, G.Martino, D.Mellis
214bmp: D:/SmartProjects/Snc/a4_bn_logo2.bmp